# EAGLE design Board Atas (EAGLE 9.6.2)
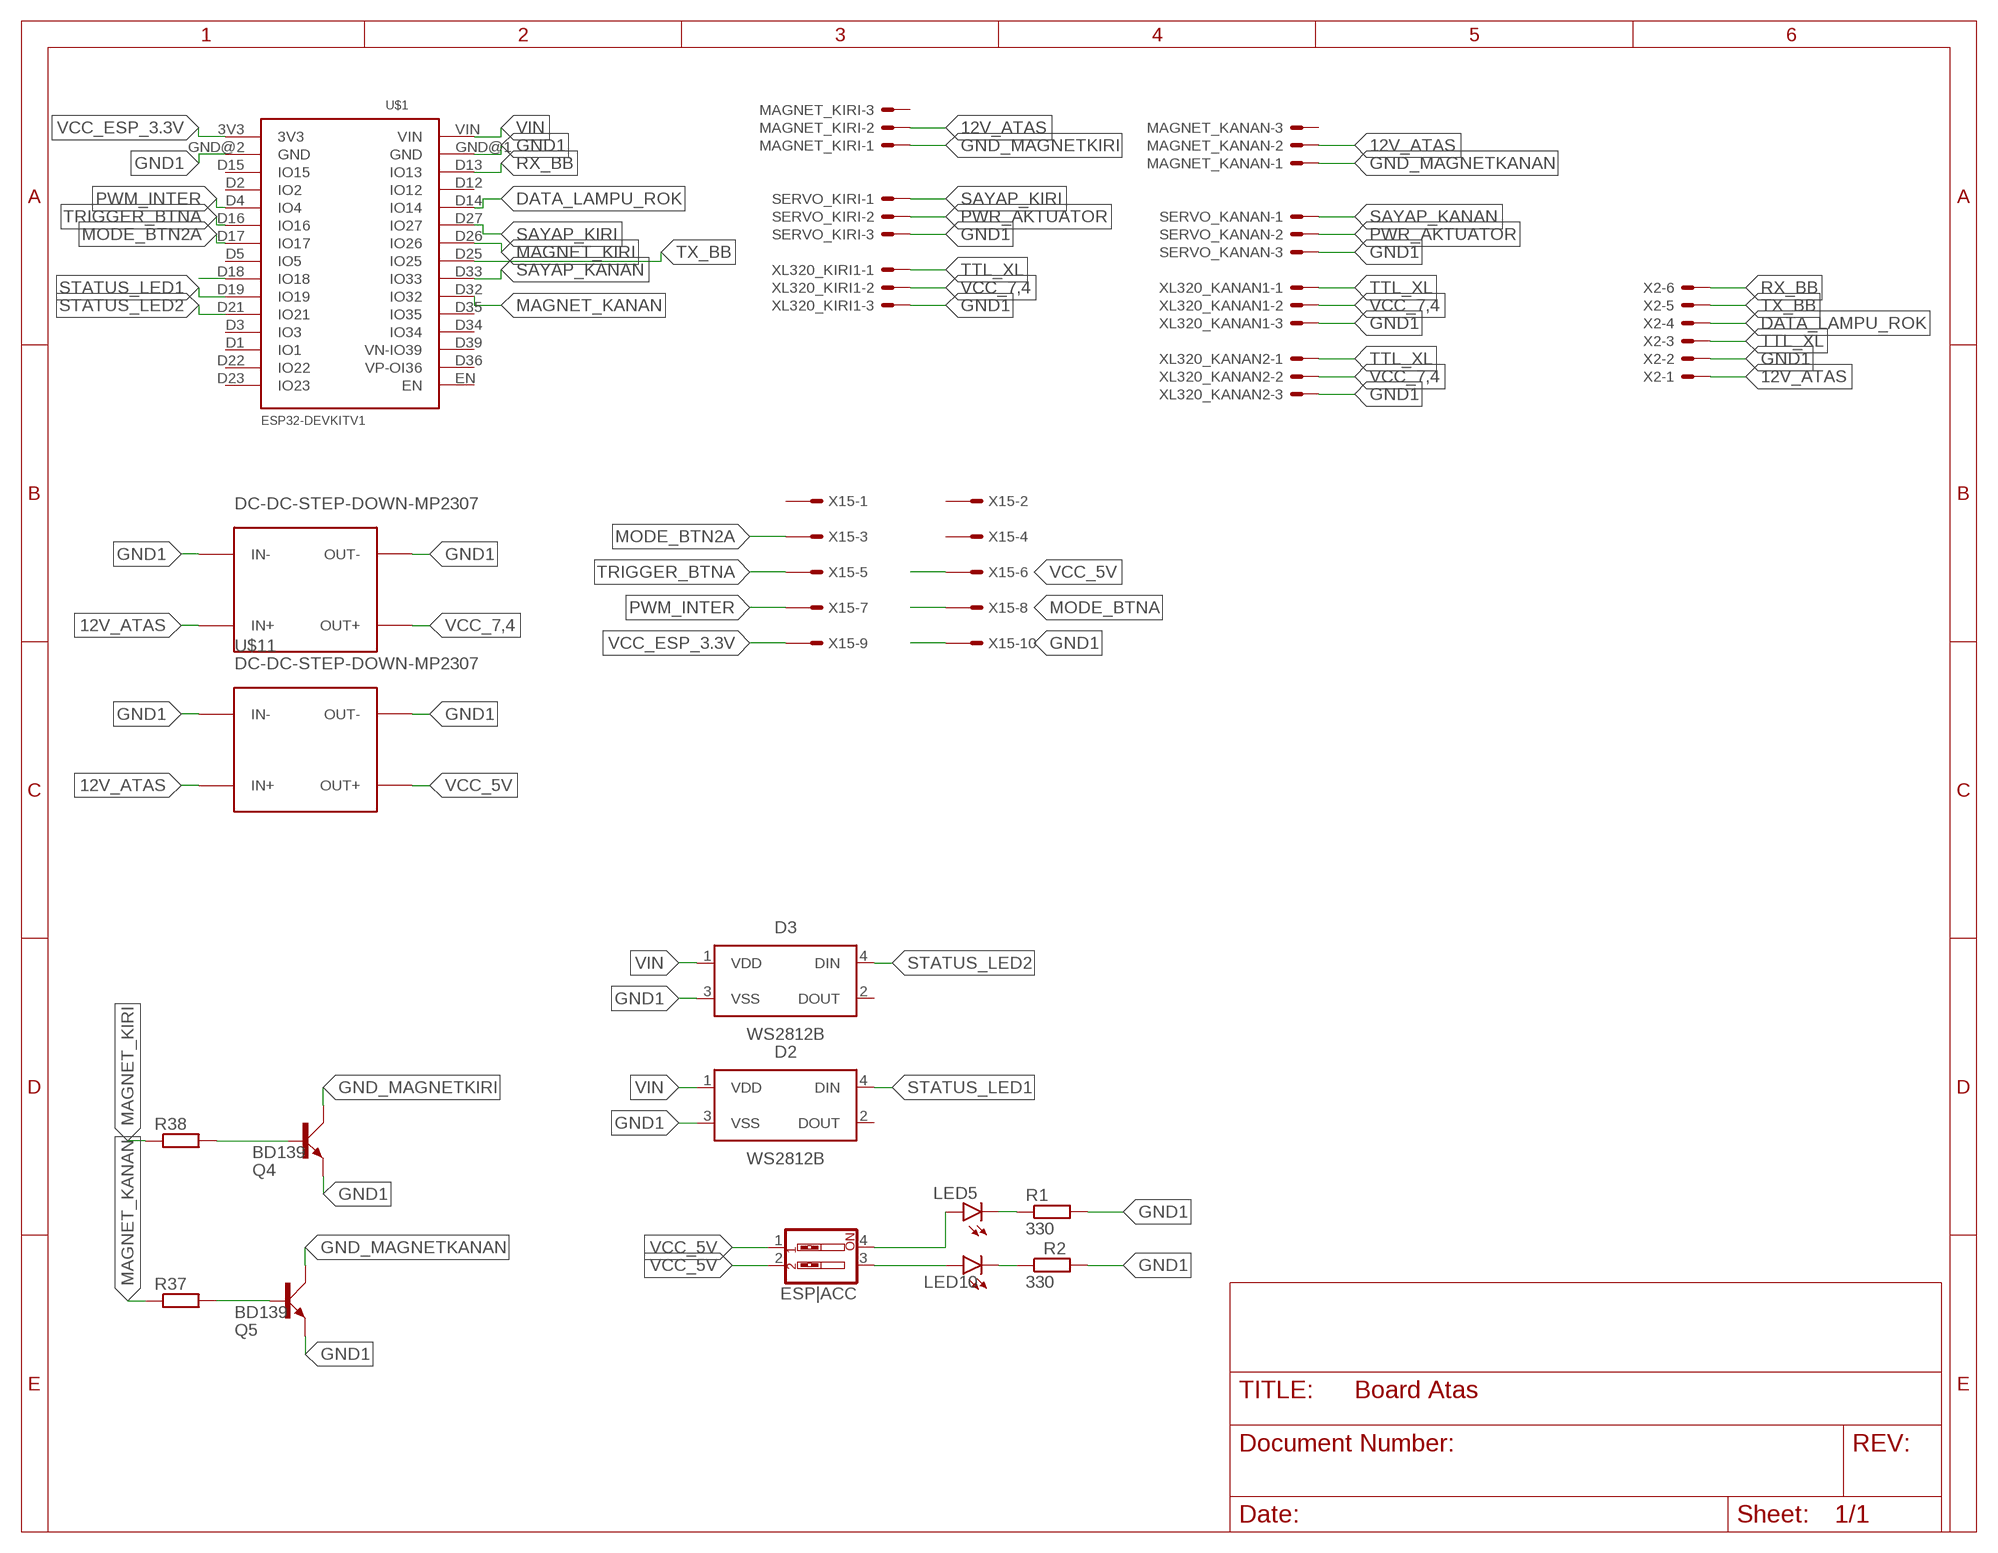
[diagram p0: schematic, sheet 1]

## Parts
D2  WS2812B  [WS2812B]
D3  WS2812B  [WS2812B]
ESP|ACC  SW_DIP-2  [EDG-02]
LED5  LEDCHIPLED_1206  [CHIPLED_1206]
LED10  LEDCHIPLED_1206  [CHIPLED_1206]
MAGNET_KANAN  22-23-2031  [22-23-2031]
MAGNET_KIRI  22-23-2031  [22-23-2031]
Q4  BD139  [TO126AV]
Q5  BD139  [TO126AV]
R1  330  R-EU_M1206  [M1206]
R2  330  R-EU_M1206  [M1206]
R37  R-EU_M0805  [M0805]
R38  R-EU_M0805  [M0805]
SERVO_KANAN  22-23-2031  [22-23-2031]
SERVO_KIRI  22-23-2031  [22-23-2031]
U$1  ESP32DEVKITV1  [ESP32-DEVKITV1]
U$8  DC-DC-STEP-DOWN-MP2307  [DC-DC-STEP-DOWN-MP2307]
U$11  DC-DC-STEP-DOWN-MP2307  [DC-DC-STEP-DOWN-MP2307]
X2  22-23-2061  [22-23-2061]
X15  057-010-1  [057-010-1]
XL320_KANAN1  22-23-2031  [22-23-2031]
XL320_KANAN2  22-23-2031  [22-23-2031]
XL320_KIRI1  22-23-2031  [22-23-2031]

## Nets
12V_ATAS: MAGNET_KANAN.2 MAGNET_KIRI.2 U$8.IN+ U$11.IN+ X2.1
DATA_LAMPU_ROK: U$1.D14(IO14) X2.4
GND1: D2.3(VSS) D3.3(VSS) Q4.E Q5.E R1.2 R2.2 SERVO_KANAN.3 SERVO_KIRI.3 U$1.GND@1(GND) U$1.GND@2(GND) U$8.IN- U$8.OUT- U$11.IN- U$11.OUT- X2.2 X15.10 XL320_KANAN1.3 XL320_KANAN2.3 XL320_KIRI1.3
GND_MAGNETKANAN: MAGNET_KANAN.1 Q5.C
GND_MAGNETKIRI: MAGNET_KIRI.1 Q4.C
MAGNET_KANAN: R37.1 U$1.D32(IO32)
MAGNET_KIRI: R38.1 U$1.D26(IO26)
MODE_BTN2A: U$1.D17(IO17) X15.3
MODE_BTNA: U$1.D18(IO18) X15.8
N$4: LED5.C R1.1
N$6: LED10.C R2.1
N$50: Q4.B R38.2
N$51: Q5.B R37.2
PWM_INTER: U$1.D4(IO4) X15.7
PWR_AKTUATOR: ESP|ACC.3 LED10.A SERVO_KANAN.2 SERVO_KIRI.2
RX_BB: U$1.D13(IO13) X2.6
SAYAP_KANAN: SERVO_KANAN.1 U$1.D33(IO33)
SAYAP_KIRI: SERVO_KIRI.1 U$1.D27(IO27)
STATUS_LED1: D2.4(DIN) U$1.D19(IO19)
STATUS_LED2: D3.4(DIN) U$1.D21(IO21)
TRIGGER_BTNA: U$1.D16(IO16) X15.5
TTL_XL: X2.3 XL320_KANAN1.1 XL320_KANAN2.1 XL320_KIRI1.1
TX_BB: U$1.D25(IO25) X2.5
VCC_5V: ESP|ACC.1 ESP|ACC.2 U$11.OUT+ X15.6
VCC_7,4: U$8.OUT+ XL320_KANAN1.2 XL320_KANAN2.2 XL320_KIRI1.2
VCC_ESP_3.3V: U$1.3V3 X15.9
VIN: D2.1(VDD) D3.1(VDD) ESP|ACC.4 LED5.A U$1.VIN
Unconnected: D2.2(DOUT) D3.2(DOUT) MAGNET_KANAN.3 MAGNET_KIRI.3 U$1.D1(IO1) U$1.D2(IO2) U$1.D3(IO3) U$1.D5(IO5) U$1.D12(IO12) U$1.D15(IO15) U$1.D22(IO22) U$1.D23(IO23) U$1.D34(IO34) U$1.D35(IO35) U$1.D36(VP-OI36) U$1.D39(VN-IO39) U$1.EN X15.1 X15.2 X15.4

## Library data of the parts
D2 D3 = LED:WS2812B: Intelligent control LED integrated light source Datasheet <http://cdn.sparkfun.com/datasheets/BreakoutBoards/WS2812B.pdf>; CATEGORY: LED; COLOR: RGB; DESCRIPTION: LED integrated light source; MANUFACTURER: Worldsemi; MPN: WS2812B; OPERATING_TEMP: -25 ℃ to +80℃(TJ); PART_STATUS: Active; SUB_CATEGORY: RGB
ESP|ACC = special:SW_DIP-2: DIP SWITCH
LED5 LED10 = led:LED: LED OSRAM: - CHIPLED LG R971, LG N971, LY N971, LG Q971, LY Q971, LO R971, LY R971 LH N974, LH R974 LS Q976, LO Q976, LY Q976 LO Q996 - Hyper CHIPLED LW Q18S LB Q993, LB Q99A, LB R99A - SideLED LS A670, LO A670, LY A670, LG A670, LP A670 LB A673, LV A673, LT A673, LW A673 LH A674 LY A675 LS A676, LA A676, LO A676, LY A676, LW A676 LS A679, LY A679, LG A679 - Hyper Micro SIDELED® LS Y876, LA Y876, LO Y876, LY Y876 LT Y87S - SmartLED LW L88C, LW L88S LB L89C, LB L89S, LG L890 LS L89K, LO L89K, LY L89K LS L896, LA L896, LO L896, LY L896 - TOPLED LS T670, LO T670, LY T670, LG T670, LP T670 LSG T670, LSP T670, LSY T670, LOP T670, LYG T670 LG T671, LOG T671, LSG T671 LB T673, LV T673, LT T673, LW T673 LH T674 LS T676, LA T676, LO T676, LY T676, LB T676, LH T676, LSB T676, LW T676 LB T67C, LV T67C, LT T67C, LS T67K, LO T67K, LY T67K, LW E67C LS E67B, LA E67B, LO E67B, LY E67B, LB E67C, LV E67C, LT E67C LW T67C LS T679, LY T679, LG T679 LS T770, LO T770, LY T770, LG T770, LP T770 LB T773, LV T773, LT T773, LW T773 LH T774 LS E675, LA E675, LY E675, LS T675 LS T776, LA T776, LO T776, LY T776, LB T776 LHGB T686 LT T68C, LB T68C - Hyper Mini TOPLED® LB M676 - Mini TOPLED Santana® LG M470 LS M47K, LO M47K, LY M47K Source: http://www.osram.convergy.de LUXEON: - LUMILED® LXK2-PW12-R00, LXK2-PW12-S00, LXK2-PW14-U00, LXK2-PW14-V00 LXK2-PM12-R00, LXK2-PM12-S00, LXK2-PM14-U00 LXK2-PE12-Q00, LXK2-PE12-R00, LXK2-PE12-S00, LXK2-PE14-T00, LXK2-PE14-U00 LXK2-PB12-K00, LXK2-PB12-L00, LXK2-PB12-M00, LXK2-PB14-N00, LXK2-PB14-P00, LXK2-PB14-Q00 LXK2-PR12-L00, LXK2-PR12-M00, LXK2-PR14-Q00, LXK2-PR14-R00 LXK2-PD12-Q00, LXK2-PD12-R00, LXK2-PD12-S00 LXK2-PH12-R00, LXK2-PH12-S00 LXK2-PL12-P00, LXK2-PL12-Q00, LXK2-PL12-R00 Source: www.luxeon.com KINGBRIGHT: KA-3528ASYC Source: www.kingbright.com
MAGNET_KANAN MAGNET_KIRI SERVO_KANAN SERVO_KIRI XL320_KANAN1 XL320_KANAN2 XL320_KIRI1 = con-molex:22-23-2031: .100" (2.54mm) Center Header - 3 Pin; MF: MOLEX; MPN: 22-23-2031; OC_FARNELL: 1462950; OC_NEWARK: 30C0862
Q4 Q5 = transistor-power:BD139: NPN TRANSISTOR
R1 R2 = rcl:R-EU_: RESISTOR, European symbol
R37 R38 = resistor:R-EU_: RESISTOR, European symbol
U$1 = ESP32-DEVKITV1:ESP32DEVKITV1
U$8 U$11 = diy-modules:DC-DC-STEP-DOWN-MP2307: DC/DC Step-Down Regulator based on MP2307DN chip MP2307 datasheet available here: https://cdn-shop.adafruit.com/datasheets/MP2307_r1.9.pdf Click here to find device on ebay.com <http://www.ebay.com/sch/dc+dc+3a+mini+converter>
X2 = con-molex:22-23-2061: .100" (2.54mm) Center Header - 6 Pin; MF: MOLEX; MPN: 22-23-2061; OC_FARNELL: 1462922; OC_NEWARK: 27C1933
X15 = con-panduit:057-010-: CONNECTOR 10-pin series 057 contact pc board low profile headers; OC_FARNELL: unknown; OC_NEWARK: unknown

## Board
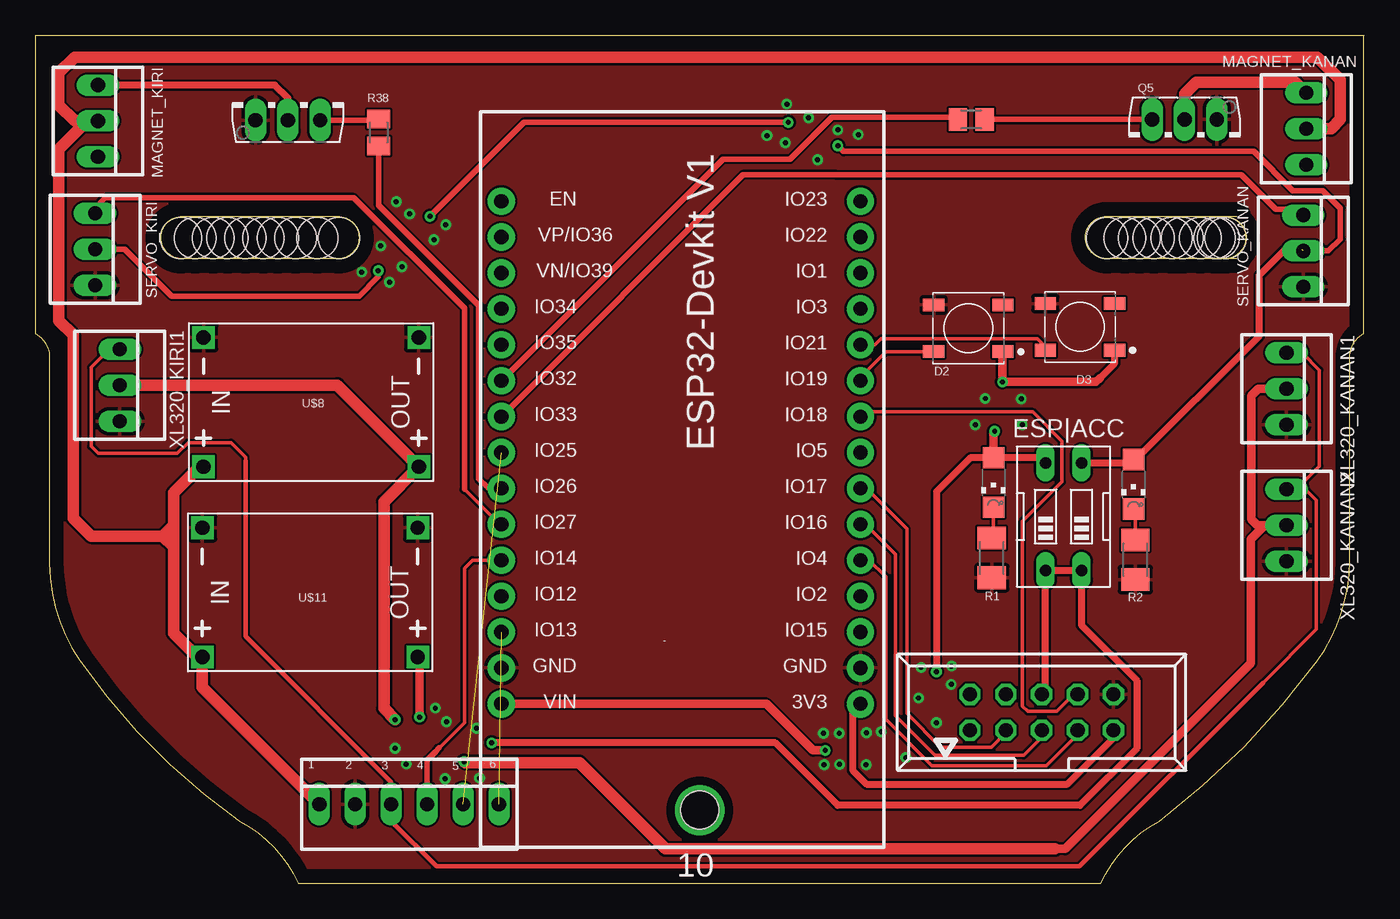
[diagram p1: board, top side]
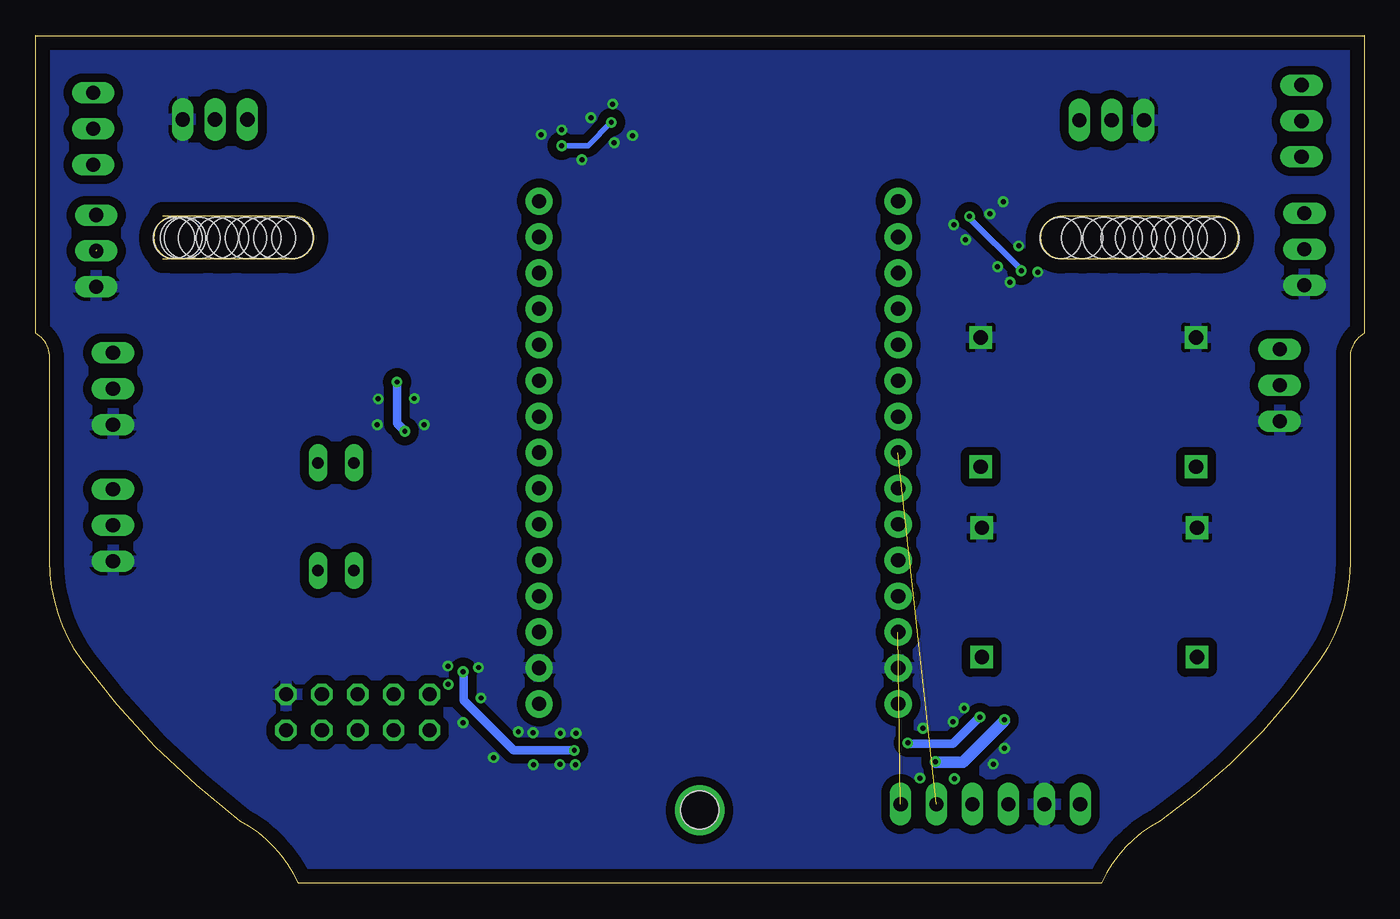
[diagram p2: board, bottom side, seen from below]

Size 94.03 x 59.99 mm. Coordinates in mm from the lower left corner, seen from the top.
Outline: 18.6,0.03 75.39,0
Outline: 94.03,59.97 0.02,59.97
Outline: 94,59.99 94,38.92 arc60 93,37.19 93,22.83 arc-36 90.7,15.77 arc-17 79.52,4.41 arc36 75.39,0
Outline: 0,59.98 0,38.92 arc-60 1,37.19 1,22.63 arc35 3.14,15.8 arc20 14.48,4.41 arc-36 18.6,0.03
Outline: 85.02,44.19 75.8,44.19 arc-180 75.8,47.19 85.02,47.19
Outline: 84.14,47.19 arc-180 84.14,44.19
Outline: 21.4,44.19 10.4,44.19 arc-180 10.4,47.19 21.4,47.19 arc-180 21.4,44.19
Copper layers (1*16): Top 0.035mm / dielectric 1.5mm / Bottom 0.035mm
Design rules "default": minimum track width 6mil, minimum drill 0.35mm, track to track 6mil, track to pad 6mil, pad to pad 6mil, via to via 6mil, smd to smd 6mil, copper to edge 40mil, drill to drill 6mil, minimum pad ring 10mil, minimum via ring 8mil, stop-mask expansion 4mil, vias tented up to drill 0mil, thermal gap 10mil
Holes 2.7 mm at 47.01,5.19
Holes 2.92 mm at 10.3,45.66 10.3,45.66 11.31,45.66 11.31,45.66 12.58,45.66 12.58,45.66 13.6,45.66 13.6,45.66 14.87,45.66 14.87,45.66 16.14,45.66 16.14,45.66 16.14,45.66 17.15,45.66 17.15,45.66 18.42,45.66 18.42,45.66 19.95,45.66 19.95,45.66 21.47,45.66 21.47,45.66 75.83,45.66 75.83,45.66 77.1,45.66 77.1,45.66 78.11,45.66 78.11,45.66 79.13,45.66 79.13,45.66 80.4,45.66 80.4,45.66 81.16,45.66 81.16,45.66 82.43,45.66 82.43,45.66 83.45,45.66 83.7,45.66 84.21,45.66 84.21,45.66

### Footprints (pad centres in the part's own frame; a part is rotated, then mirrored left to right if it is on the bottom)
WS2812B = smd 1.5 x 0.9: 1 -2.45,1.65; 2 -2.45,-1.65; 3 2.45,-1.65; 4 2.45,1.65
EDG-02 = drill 0.813 long: 1 -1.27,-3.81; 2 1.27,-3.81; 3 1.27,3.81; 4 -1.27,3.81
CHIPLED_1206 = smd 1.5 x 1.5: A 0,-1.75; C 0,1.75
22-23-2031 = drill 1 long: 1 -2.54,0; 2 0,0; 3 2.54,0
TO126AV = drill 1.016 long: B 2.286,-1.27; C 0,-1.27; E -2.286,-1.27
M1206 = smd 1.6 x 2: 1 -1.4,0; 2 1.4,0
M0805 = smd 1.3 x 1.6: 1 -0.95,0; 2 0.95,0
ESP32-DEVKITV1 = drill 1 pad 1.93: 3V3 -16.52,-12.27; D1 13.96,-12.27; D2 -8.9,-12.27; D3 11.42,-12.27; D4 -6.36,-12.27; D5 1.26,-12.27; D12 -8.9,13.135; D13 -11.44,13.135; D14 -6.36,13.135; D15 -11.44,-12.27; D16 -3.82,-12.27; D17 -1.28,-12.27; D18 3.8,-12.27; D19 6.34,-12.27; D21 8.88,-12.27; D22 16.5,-12.27; D23 19.04,-12.27; D25 1.26,13.135; D26 -1.28,13.135; D27 -3.82,13.135; D32 6.34,13.135; D33 3.8,13.135; D34 11.42,13.135; D35 8.88,13.135; D36 16.5,13.135; D39 13.96,13.135; EN 19.04,13.135; GND@1 -13.98,13.135; GND@2 -13.98,-12.27; VIN -16.52,13.135
DC-DC-STEP-DOWN-MP2307 = drill 1 pad 1.6 square: IN+ -7.62,-4.572; IN- -7.62,4.572; OUT+ 7.62,-4.572; OUT- 7.62,4.572
22-23-2061 = drill 1 long: 1 -6.35,0; 2 -3.81,0; 3 -1.27,0; 4 1.27,0; 5 3.81,0; 6 6.35,0
057-010-1 = drill 1 octagon: 1 -5.08,-1.27; 2 -5.08,1.27; 3 -2.54,-1.27; 4 -2.54,1.27; 5 0,-1.27; 6 0,1.27; 7 2.54,-1.27; 8 2.54,1.27; 9 5.08,-1.27; 10 5.08,1.27

### Placement (x,y rotation side)
D2  66.02,39.27 180 top
D3  73.92,39.37 180 top
ESP|ACC  72.75,25.95 0 top
LED5  67.8,28.36 180 top
LED10  77.71,28.23 180 top
MAGNET_KANAN  89.93,53.38 270 top
MAGNET_KIRI  4.43,53.94 270 top
Q4  17.87,55.26 0 top
Q5  81.31,52.77 180 top
R1  67.67,23.03 270 top
R2  77.83,22.9 270 top
R37  66.23,54.04 0 top
R38  24.29,53.13 90 top
SERVO_KANAN  89.72,44.74 270 top
SERVO_KIRI  4.23,44.87 270 top
U$1  46.11,29.22 90 top
U$8  19.52,34.05 0 top
U$11  19.44,20.59 0 top
X2  26.45,5.61 0 top
X15  71.21,12.11 0 top
XL320_KANAN1  88.53,34.99 270 top
XL320_KANAN2  88.53,25.34 270 top
XL320_KIRI1  5.98,35.24 270 top

### Tracks (layer width: path | path; a pad name or v marks a point on that pad's centre or on a via)
12V_ATAS
  Top 0.813: MAGNET_KANAN.2 91.68,53.38 92.34,54.04 92.34,56.83 90.71,58.46 2.78,58.46 1.66,57.34 1.66,55.06 2.78,53.94 MAGNET_KIRI.2 3.67,53.94 1.66,51.93 1.66,39.82 2.68,38.8 2.68,25.85 3.95,24.58 9.03,24.58 | 9.79,25.34 9.79,27.62 11.64,29.48 U$8.IN+ | 9.79,23.81 9.79,17.72 11.49,16.02 U$11.IN+ 11.82,13.89 X2.1 | 9.79,23.81 9.79,24.32 | 9.79,24.32 9.53,24.58 9.03,24.58 | 9.79,24.32 9.79,25.34 | 9.03,24.58 9.79,25.34 | 9.03,24.58 9.79,23.81
DATA_LAMPU_ROK
  Top 0.254: 28.33,9.34 30.36,11.37 30.36,22.29 30.94,22.86 U$1.D14
  Top 0.406: X2.4 27.72,8.72 28.33,9.34 28.58,9.59
GND1  (via drill 0.35)
  other vias: 31.23,10.99 64.8,14.09 63.76,11.37 62.67,15.28 55.76,10.63 56.91,8.42 56.88,10.63 24.44,45.1 26.48,47.36 28.2,45.53 25.94,43.63 54.72,54.17 53.07,52.39 56.78,53.3 55.36,51.2 23.1,43.25 25.05,42.53 25.54,48.22 29.04,46.6 53.17,55.13 51.77,52.9 58.23,52.97 58.81,10.66 29.09,11.44 62.49,13.12 28.99,7.41 59.85,10.73 26.25,8.45 55.81,8.4 64.83,15.38 61.6,8.9 58.78,8.4 25.46,9.56 67.22,34.3 66.51,32.45 69.76,34.28 69.83,32.45 28.3,12.41 31.43,7.46
  pour Bottom (isolate 0.61): 0.39,59.63 93.61,59.63 93.61,40.07 92.34,38.8 92.34,19.51 arc-14 83.46,8.85 arc0 77.35,3.62 arc17 74.81,0.7 19.78,0.7 arc20 14.36,5.4 arc-17 9.03,9.84 arc-1 4.07,15.56 arc-41 1.79,21.91 arc1 1.79,37.4 arc57 0.39,39.89
  pour Top: -0.12,60.14 -0.12,39.05 0.9,38.04 0.9,21.78 1.91,17.72 4.96,13.4 8.26,9.59 13.09,5.27 16.14,3.24 17.66,1.72 18.68,-0.06 75.32,-0.06 76.59,1.97 78.62,3.75 86.25,10.92 91.01,16.32 92.34,18.48 93.1,21.78 93.1,37.53 93.35,38.29 94.12,39.05 94.12,60.14
GND_MAGNETKANAN
  Top 0.813: MAGNET_KANAN.1 89.16,56.68 82.16,56.68 81.34,55.87 Q5.C
GND_MAGNETKIRI
  Top 0.508: Q4.C 17.87,55.56 16.95,56.48 MAGNET_KIRI.1
MAGNET_KANAN
  Top 0.406: R37.1 65.12,54.19 56.35,54.19 53.4,51.24 48.65,51.24 U$1.D32
  Top 0.61: R37.1 64.95,54.04
MAGNET_KIRI
  Top 0.406: U$1.D26 32.07,27.94 31.38,28.64 31.38,40.9 24.29,47.98 R38.1
MODE_BTN2A
  Top 0.254: U$1.D17 58.42,27.98 58.76,27.98 61.66,25.08 61.66,12.03 64.03,9.65 67.64,9.65 68.67,10.68 X15.3
MODE_BTNA
  Top 0.254: 73.62,13.51 X15.8 73.49,13.38 72.3,12.18 70.21,12.18 69.86,12.54 69.86,25.62 72.65,28.41 72.65,31.28 70.58,33.35 58.71,33.35 U$1.D18
N$4
  Top 0.254: LED5.C 67.8,24.55 R1.1
N$6
  Top 0.254: 78.06,26.83 LED10.C 77.83,26.36 R2.1
  Top 0.508: LED10.C 77.33,26.1
N$50
  Top 0.406: R38.2 24.29,53.99 Q4.B
N$51
  Top 0.254: 75.27,54.01 79,54.01 Q5.B
  Top 0.406: 67.2,54.01 R37.2 78.98,54.04 79,54.01
N$86  (via drill 2.5 pad 3)
  other vias: 47.02,5.18
PWM_INTER
  Top 0.254: U$1.D4 59,22.86 60.18,21.68 60.18,11.62 63.45,8.35 71.54,8.35 73.75,10.56 X15.7
PWR_AKTUATOR  (via drill 0.35)  (1 unrouted)
  Top 0.406: SERVO_KANAN.2 91.5,44.74 92.34,45.58 92.34,47.77 91.09,49.01 88.99,49.01 86.22,51.78 57.18,51.78 v56.78,52.19 | v27.92,47.18 34.58,53.84 v53.27,53.84 | v24.27,43.35 24.27,42.91 22.89,41.54 9.66,41.54 6.34,44.87 SERVO_KIRI.2
  Top 0.508: LED10.A 77.48,29.76 ESP|ACC.3 77.63,29.76 86.6,38.72 86.6,43.02 88.4,44.82 89.65,44.82
  Bottom 0.406: v56.78,52.19 54.92,52.19 v53.27,53.84 | v27.92,47.18 27.92,47.05 24.27,43.4 v24.27,43.35
  Bottom 0.813: 5.25,44.87 SERVO_KIRI.2
RX_BB  (1 unrouted)
SAYAP_KANAN
  Top 0.406: SERVO_KANAN.1 89.31,47.69 87.77,47.69 85.33,50.13 56.69,50.13 56.68,50.12 50.07,50.12 U$1.D33
SAYAP_KIRI
  Top 0.254: 30.36,27.88 32.84,25.4 U$1.D27
  Top 0.406: SERVO_KIRI.1 4.23,47.77 4.96,48.5 22.54,48.5 30.36,40.68 30.36,27.88
STATUS_LED1
  Top 0.254: U$1.D19 58.38,35.82 60.18,37.62 D2.4
  Top 0.61: D2.4 63.46,37.51
STATUS_LED2
  Top 0.254: U$1.D21 59.4,38.1 59.84,38.55 70.9,38.55 71.47,37.98 D3.4
TRIGGER_BTNA
  Top 0.254: U$1.D16 58.53,25.55 58.59,25.55 60.87,23.28 60.87,11.86 63.67,9.06 69.94,9.06 71.21,10.33 X15.5
TTL_XL
  Top 0.254: XL320_KIRI1.1 5.22,37.78 3.95,36.51 3.95,30.93 4.45,30.42 10.04,30.42 10.8,31.18 13.85,31.18 14.87,30.16 14.87,29.91 | 86.88,14.21 90.64,17.97 90.64,27.12 89.87,27.88 XL320_KANAN2.1 89.21,27.88 90.87,29.53 90.87,36.31 89.65,37.53 XL320_KANAN1.1
  Top 0.305: 14.87,29.91 14.87,17.47 25.18,7.16 X2.3 25.18,4.41 28.38,1.21 73.87,1.21 86.88,14.21
TX_BB  (1 unrouted)
VCC_5V  (via drill 0.35)
  Top 0.508: ESP|ACC.2 74.02,21.83 74.01,21.82 | ESP|ACC.2 ESP|ACC.1 71.48,13.65 X15.6 | ESP|ACC.2 74.02,18.28 77.94,14.37 77.94,9.54 73.92,5.53 56.78,5.53 52.36,9.95 v32.29,9.95
  Top 0.61: U$11.OUT+ 27.19,15.89 v27.19,11.77
  Bottom 0.61: v32.29,9.95 32.24,9.89 29.09,9.89 27.21,11.77 v27.19,11.77
VCC_7,4  (via drill 0.35)
  Top 0.61: XL320_KANAN1.2 86.55,34.99 86.04,34.48 86.04,25.77 86.47,25.34 XL320_KANAN2.2 87,25.34 86.01,24.35 86.01,15.59 72.87,2.45 72.15,2.45
  Top 0.813: XL320_KIRI1.2 21.37,35.24 U$8.OUT+ 24.67,27.01 24.67,12.38 v25.46,11.6 | v30.34,8.62 30.41,8.55 38.49,8.55 44.59,2.45 72.15,2.45
  Bottom 0.813: v25.46,11.6 25.46,11.52 28.41,8.57 30.29,8.57 v30.34,8.62
VCC_ESP_3.3V
  Top 0.508: U$1.3V3 57.82,12.15 57.82,8.01 58.81,7.02 73.03,7.02 76.29,10.28 X15.9
VIN  (via drill 0.35)
  Top 0.508: 75.32,35.75 76.37,36.8 D3.1 | D2.1 68.47,37.53 | 68.47,37.53 68.47,36.51 | 68.46,37.52 68.47,37.53 | ESP|ACC.4 71.13,30.11 LED5.A 66.15,30.11 63.76,27.73 v63.76,14.97
  Top 0.61: v55.89,9.41 55.03,9.41 51.73,12.7 U$1.VIN | LED5.A 67.8,31.92 v67.88,31.99 | D2.1 68.44,37.59 v68.44,35.47 75.04,35.47 75.32,35.75
  Bottom 0.61: v63.76,14.97 63.74,14.95 63.74,12.97 60.18,9.41 v55.89,9.41 | v67.88,31.99 68.44,32.55 v68.44,35.47

### Text on the board
tPlace: 1 | 2 | 3 | 4 | 5 | 6 | 10